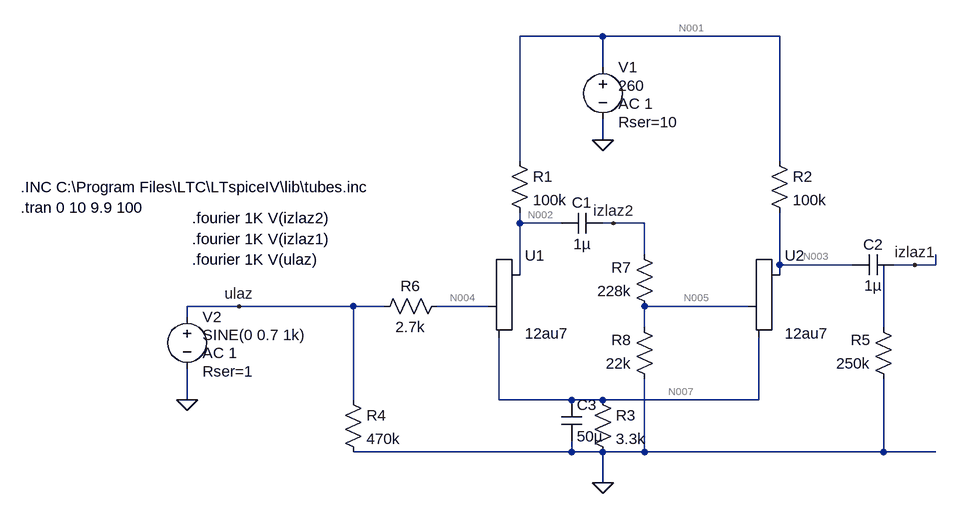
[diagram p0: schematic Draft3.asc]
Draft3.asc, the LTspice schematic file:
Version 4
SHEET 1 1380 680
WIRE 768 -160 640 -160
WIRE 1040 -160 768 -160
WIRE 768 -112 768 -160
WIRE 768 0 768 -32
WIRE 640 32 640 -160
WIRE 1040 32 1040 -160
WIRE 640 128 640 112
WIRE 704 128 640 128
WIRE 784 128 768 128
WIRE 832 128 784 128
WIRE 832 176 832 128
WIRE 1040 192 1040 112
WIRE 1152 192 1040 192
WIRE 1248 192 1216 192
WIRE 1280 192 1280 176
WIRE 1280 192 1248 192
WIRE 640 208 640 128
WIRE 1040 208 1040 192
WIRE 208 256 128 256
WIRE 384 256 208 256
WIRE 432 256 384 256
WIRE 592 256 512 256
WIRE 992 256 832 256
WIRE 128 272 128 256
WIRE 832 288 832 256
WIRE 1200 288 1200 192
WIRE 128 400 128 352
WIRE 384 400 384 256
WIRE 608 400 608 304
WIRE 720 400 608 400
WIRE 768 400 720 400
WIRE 1008 400 1008 304
WIRE 1008 400 768 400
WIRE 720 480 720 464
WIRE 720 480 384 480
WIRE 768 480 720 480
WIRE 832 480 832 368
WIRE 832 480 768 480
WIRE 1200 480 1200 368
WIRE 1200 480 832 480
WIRE 1280 480 1200 480
WIRE 768 528 768 480
FLAG 768 528 0
FLAG 768 0 0
FLAG 128 400 0
FLAG 208 256 ulaz
FLAG 1248 192 izlaz1
FLAG 784 128 izlaz2
SYMBOL Misc\\triode 640 256 R0
SYMATTR InstName U1
SYMATTR Value 12au7
SYMBOL Misc\\triode 1040 256 R0
SYMATTR InstName U2
SYMATTR Value 12au7
SYMBOL voltage 768 -128 R0
WINDOW 3 24 44 Left 2
WINDOW 123 24 72 Left 2
WINDOW 39 24 100 Left 2
SYMATTR Value 260
SYMATTR Value2 AC 1
SYMATTR SpiceLine Rser=10
SYMATTR InstName V1
SYMBOL res 624 16 R0
SYMATTR InstName R1
SYMATTR Value 100k
SYMBOL res 1024 16 R0
SYMATTR InstName R2
SYMATTR Value 100k
SYMBOL res 752 384 R0
SYMATTR InstName R3
SYMATTR Value 3.3k
SYMBOL res 368 384 R0
SYMATTR InstName R4
SYMATTR Value 470k
SYMBOL res 528 240 R90
WINDOW 0 0 56 VBottom 2
WINDOW 3 32 56 VTop 2
SYMATTR InstName R6
SYMATTR Value 2.7k
SYMBOL res 848 272 R180
WINDOW 0 36 76 Left 2
WINDOW 3 36 40 Left 2
SYMATTR InstName R7
SYMATTR Value 228k
SYMBOL res 848 384 R180
WINDOW 0 36 76 Left 2
WINDOW 3 36 40 Left 2
SYMATTR InstName R8
SYMATTR Value 22k
SYMBOL voltage 128 256 R0
WINDOW 3 24 44 Left 2
WINDOW 123 24 72 Left 2
WINDOW 39 24 100 Left 2
SYMATTR Value SINE(0 0.7 1k)
SYMATTR Value2 AC 1
SYMATTR SpiceLine Rser=1
SYMATTR InstName V2
SYMBOL cap 768 112 R90
WINDOW 0 0 32 VBottom 2
WINDOW 3 32 32 VTop 2
SYMATTR InstName C1
SYMATTR Value 1µ
SYMBOL cap 1216 176 R90
WINDOW 0 0 32 VBottom 2
WINDOW 3 32 32 VTop 2
SYMATTR InstName C2
SYMATTR Value 1µ
SYMBOL res 1216 384 R180
WINDOW 0 36 76 Left 2
WINDOW 3 36 40 Left 2
SYMATTR InstName R5
SYMATTR Value 250k
SYMBOL cap 704 400 R0
SYMATTR InstName C3
SYMATTR Value 50µ
TEXT -128 72 Left 2 !.INC C:\\Program Files\\LTC\\LTspiceIV\\lib\\tubes.inc
TEXT -128 104 Left 2 !.tran 0 10 9.9 100
TEXT 136 184 Left 2 !.fourier 1K V(ulaz)
TEXT 136 152 Left 2 !.fourier 1K V(izlaz1)
TEXT 136 120 Left 2 !.fourier 1K V(izlaz2)

The netlist it stands for:
* Draft3.asc
XU1 N002 N004 N007 12au7
XU2 N003 N005 N007 12au7
V1 N001 0 260 AC 1 Rser=10
R1 N001 N002 100k
R2 N001 N003 100k
R3 N007 0 3.3k
R4 ulaz 0 470k
R6 N004 ulaz 2.7k
R7 N005 izlaz2 228k
R8 0 N005 22k
V2 ulaz 0 SINE(0 0.7 1k) AC 1 Rser=1
C1 izlaz2 N002 1µ
C2 izlaz1 N003 1µ
R5 0 N006 250k
C3 N007 0 50µ
.INC C:\Program Files\LTC\LTspiceIV\lib\tubes.inc
.tran 0 10 9.9 100
.fourier 1K V(ulaz)
.fourier 1K V(izlaz1)
.fourier 1K V(izlaz2)
.backanno
.end

* Results of the author's LTspice run, read from the files saved beside the schematic
* Operating Point, zero values left out:
*   V(n002) = 142.8 V
*   V(n007) = 7.731 V
*   V(n004) = 2.722 µV
*   V(n003) = 142.8 V
*   V(n005) = 22.17 µV
*   V(n001) = 260 V
*   V(izlaz2) = 22.17 µV
*   V(izlaz1) = 142.8 µV
*   I(R8) = -1.008 nA
*   I(R6) = 1.008 nA
*   I(R3) = 2.343 mA
*   I(R2) = 1.171 mA
*   I(R1) = 1.171 mA
*   I(V2) = 1.008 nA
*   I(V1) = -2.343 mA
*   Ix(u1:1) = 1.171 mA
*   Ix(u1:2) = -1.008 nA
*   Ix(u1:3) = -1.171 mA
*   Ix(u2:1) = 1.171 mA
*   Ix(u2:2) = -1.008 nA
*   Ix(u2:3) = -1.171 mA
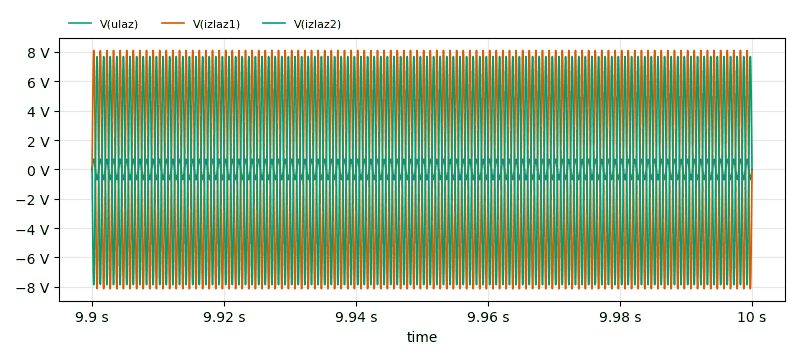
[diagram p1: Transient Analysis of Draft3.asc, plotted from the saved traces]
* Transient Analysis, 1 run:
*   V(ulaz): min -697.8 mV, max 697.8 mV, average 4.373 µV, rms 494.1 mV, last -137.6 nV
*   V(izlaz1): min -8.135 V, max 8.111 V, average -31.18 mV, rms 5.752 V, last -93.38 mV
*   V(izlaz2): min -7.857 V, max 7.692 V, average -6.681 mV, rms 5.505 V, last 89.26 mV
* From the log:
*   N-Period=1
*   Fourier components of V(ulaz)
*   DC component:-0.000222066
*   Harmonic  Frequency   Fourier   Normalized   Phase    Normalized
*    Number     [Hz]     Component   Component  [degree]  Phase [deg]
*       1     1.000e+03  6.835e-01  1.000e+00      0.37°      0.00°
*       2     2.000e+03  4.233e-04  6.193e-04    -55.77°    -56.14°
*       3     3.000e+03  1.443e-02  2.112e-02   -163.86°   -164.23°
*       4     4.000e+03  3.653e-04  5.345e-04    -22.41°    -22.78°
*       5     5.000e+03  7.097e-04  1.038e-03    -93.02°    -93.39°
*       6     6.000e+03  2.833e-04  4.145e-04      8.80°      8.43°
*       7     7.000e+03  2.418e-04  3.537e-04    -63.84°    -64.21°
*       8     8.000e+03  1.957e-04  2.863e-04     35.34°     34.97°
*       9     9.000e+03  1.010e-03  1.478e-03    -73.89°    -74.26°
*   Total Harmonic Distortion: 2.122017%(2.142610%)
*   N-Period=1
*   Fourier components of V(izlaz1)
*   DC component:-0.0343248
*   Harmonic  Frequency   Fourier   Normalized   Phase    Normalized
*    Number     [Hz]     Component   Component  [degree]  Phase [deg]
*       1     1.000e+03  7.957e+00  1.000e+00      0.09°      0.00°
*       2     2.000e+03  2.174e-02  2.733e-03    -81.82°    -81.91°
*       3     3.000e+03  1.669e-01  2.098e-02   -163.79°   -163.88°
*       4     4.000e+03  4.249e-03  5.340e-04     -3.95°     -4.04°
*       5     5.000e+03  8.586e-03  1.079e-03    -89.24°    -89.33°
*       6     6.000e+03  4.116e-03  5.172e-04      2.80°      2.71°
*       7     7.000e+03  3.249e-03  4.083e-04    -54.46°    -54.55°
*       8     8.000e+03  2.804e-03  3.524e-04     25.43°     25.34°
*       9     9.000e+03  1.202e-02  1.510e-03    -71.54°    -71.63°
*   Total Harmonic Distortion: 2.125345%(2.146314%)
*   N-Period=1
*   Fourier components of V(izlaz2)
*   DC component:-0.00262449
*   Harmonic  Frequency   Fourier   Normalized   Phase    Normalized
*    Number     [Hz]     Component   Component  [degree]  Phase [deg]
*       1     1.000e+03  7.616e+00  1.000e+00   -179.66°      0.00°
*       2     2.000e+03  7.460e-02  9.795e-03     92.11°    271.77°
*       3     3.000e+03  1.599e-01  2.099e-02     17.04°    196.71°
*       4     4.000e+03  6.222e-03  8.170e-04   -134.52°     45.15°
*       5     5.000e+03  9.059e-03  1.190e-03     99.31°    278.97°
*       6     6.000e+03  6.013e-03  7.896e-04    174.20°    353.87°
*       7     7.000e+03  3.820e-03  5.017e-04    133.39°    313.05°
*       8     8.000e+03  4.202e-03  5.518e-04   -169.19°     10.47°
*       9     9.000e+03  1.175e-02  1.543e-03    110.36°    290.03°
*   Total Harmonic Distortion: 2.328528%(2.348245%)